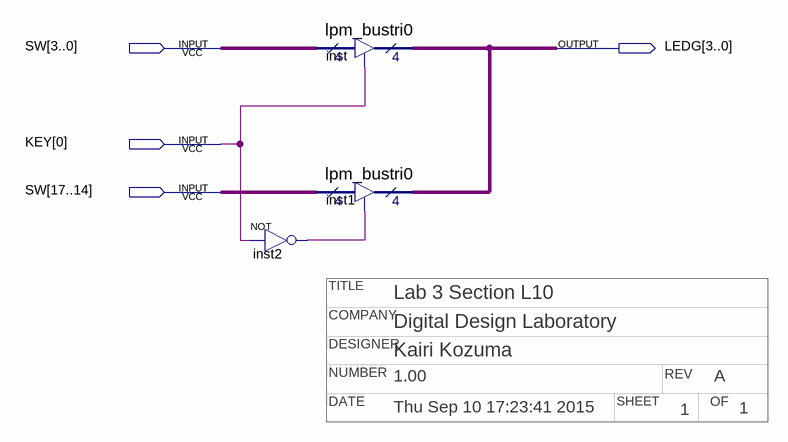
[diagram p0: schematic sheet]
// Quartus schematic lab_3.bdf as structural Verilog: 3 symbols, 4 pins
// Title block: TITLE: Lab 3 Section L10; COMPANY: Digital Design Laboratory; DESIGNER: Kairi Kozuma; NUMBER: 1.00; REV: A; DATE: Thu Sep 10 17:23:41 2015; SHEET: 1; OF: 1
module lab_3 (
  input  [17:0] SW,
  input  [0:0] KEY,
  output [3:0] LEDG
);

  wire inst2_out;

  not inst2 (inst2_out, KEY[0]);
  lpm_bustri0 inst (.enabledt(KEY[0]), .data(SW[3:0]), .tridata(LEDG));
  lpm_bustri0 inst1 (.enabledt(inst2_out), .data(SW[17:14]), .tridata(LEDG));
endmodule
